# Altium schematic sheet Placa_Receptaculo_Gases_Sheet.SchDoc: Placa receptáculo gases
size 381 x 241 mm; Date: 19/10/2025; Author: Gerson T.& Lotfi D.; Organization: Universidad Distrital Francisco José de Caldas; DocumentNumber: 5; Revision: 1.0; SheetNumber: 5; SheetTotal: 5; Time: 16:24
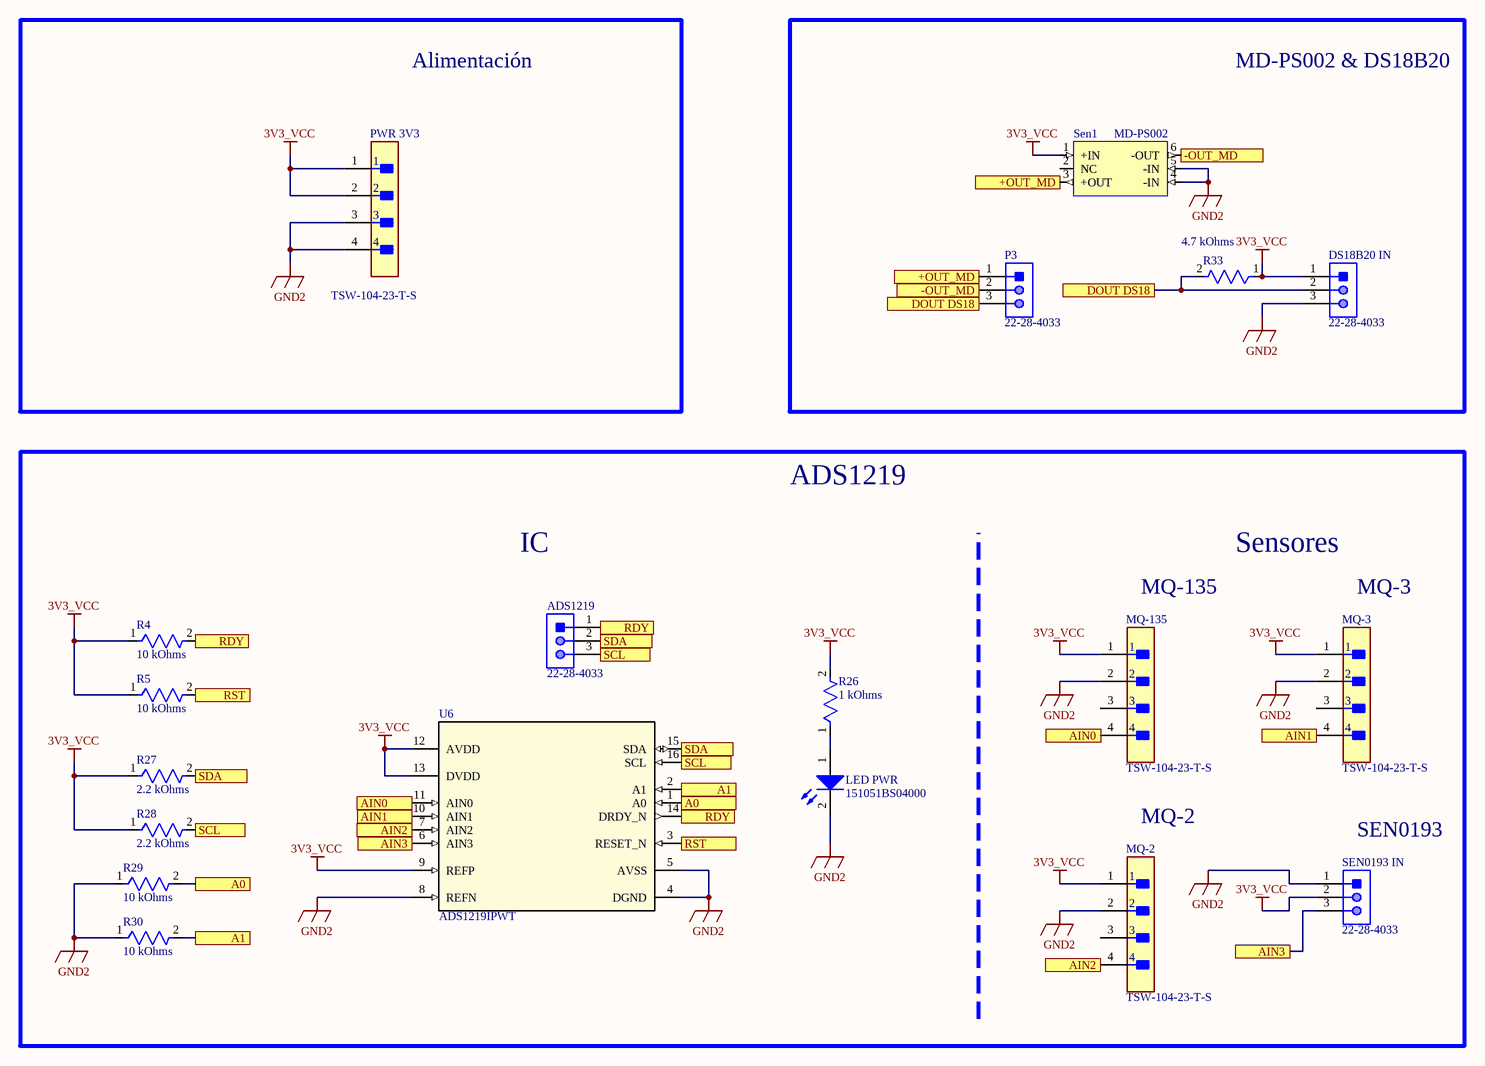
[diagram p0: Placa_Receptaculo_Gases_Sheet.SchDoc]

## Parts
ADS1219  22-28-4033  [MOLX-22-28-4033_V]
DS18B20_IN  22-28-4033  [MOLX-22-28-4033_V]
LED_PWR  151051BS04000  [WL-TMRC_D5.9H8.7]
MQ-2  TSW-104-23-T-S  [FP-TSW-104-23-T-S-MFG]
MQ-3  TSW-104-23-T-S  [FP-TSW-104-23-T-S-MFG]
MQ-135  TSW-104-23-T-S  [FP-TSW-104-23-T-S-MFG]
P3  22-28-4033  [MOLX-22-28-4033_V]
PWR_3V3  TSW-104-23-T-S  [FP-TSW-104-23-T-S-MFG]
R4  10 kOhms  [FP-FMP100-MFG]
R5  10 kOhms  [FP-FMP100-MFG]
R26  1 kOhms  [FP-FMP100-MFG]
R27  2.2 kOhms  [FP-FMP100-MFG]
R28  2.2 kOhms  [FP-FMP100-MFG]
R29  10 kOhms  [FP-FMP100-MFG]
R30  10 kOhms  [FP-FMP100-MFG]
R33  4.7 kOhms  [FP-FMP100-MFG]
Sen1  MD-PS002  [SPO-6 (MD-PS002)]
SEN0193_IN  22-28-4033  [MOLX-22-28-4033_V]
U6  ADS1219IPWT  [PW0016A_N]

## Blocks framed on the sheet
Alimentación: PWR_3V3
MD-PS002 & DS18B20: DS18B20_IN P3 R33 Sen1

## Ports
+OUT_MD (see Placa_Receptaculo_Gases_Sheet[4A]), +OUT_MD (see Placa_Receptaculo_Gases_Sheet[4B]), -OUT_MD (see Placa_Receptaculo_Gases_Sheet[4B]), -OUT_MD (see Placa_Receptaculo_Gases_Sheet[5A]), A0 (see Placa_Receptaculo_Gases_Sheet[2C]), A0 (see Placa_Receptaculo_Gases_Sheet[3C]), A1 (see Placa_Receptaculo_Gases_Sheet[2D]), A1 (see Placa_Receptaculo_Gases_Sheet[3C]), AIN0 (see Placa_Receptaculo_Gases_Sheet[2C]), AIN0 (see Placa_Receptaculo_Gases_Sheet[4C]), AIN1 (see Placa_Receptaculo_Gases_Sheet[2C]), AIN1 (see Placa_Receptaculo_Gases_Sheet[5C]), AIN2 (see Placa_Receptaculo_Gases_Sheet[2C]), AIN2 (see Placa_Receptaculo_Gases_Sheet[4D]), AIN3 (see Placa_Receptaculo_Gases_Sheet[2C]), AIN3 (see Placa_Receptaculo_Gases_Sheet[5D]), DOUT DS18 (see Placa_Receptaculo_Gases_Sheet[4B]), RDY (see Placa_Receptaculo_Gases_Sheet[2C], Placa_Receptaculo_Gases_Sheet[3C]), RDY (see Placa_Receptaculo_Gases_Sheet[3C]), RST (see Placa_Receptaculo_Gases_Sheet[2C]), RST (see Placa_Receptaculo_Gases_Sheet[3C]), SCL (see Placa_Receptaculo_Gases_Sheet[2C], Placa_Receptaculo_Gases_Sheet[3C]), SCL (see Placa_Receptaculo_Gases_Sheet[3C]), SDA (see Placa_Receptaculo_Gases_Sheet[2C], Placa_Receptaculo_Gases_Sheet[3C]), SDA (see Placa_Receptaculo_Gases_Sheet[3C])

## Nets
3V3_VCC: DS18B20_IN.1 MQ-2.1 MQ-3.1 MQ-135.1 PWR_3V3.1 PWR_3V3.2 R4.1 R5.1 R26.2 R27.1 R28.1 R33.1 Sen1.1(+IN) SEN0193_IN.2 U6.9(REFP) U6.12(AVDD) U6.13(DVDD)
GND2: DS18B20_IN.3 LED_PWR.2(K) MQ-2.2 MQ-3.2 MQ-135.2 PWR_3V3.3 PWR_3V3.4 R29.1 R30.1 Sen1.4(-IN) Sen1.5(-IN) SEN0193_IN.1 U6.4(DGND) U6.5(AVSS) U6.8(REFN)
+OUT_MD: P3.1 Sen1.3(+OUT) ; port +OUT_MD
-OUT_MD: P3.2 Sen1.6(-OUT) ; port -OUT_MD
A0: R29.2 U6.1(A0) ; port A0
A1: R30.2 U6.2(A1) ; port A1
AIN0: MQ-135.4 U6.11(AIN0) ; port AIN0
AIN1: MQ-3.4 U6.10(AIN1) ; port AIN1
AIN2: MQ-2.4 U6.7(AIN2) ; port AIN2
AIN3: SEN0193_IN.3 U6.6(AIN3) ; port AIN3
DOUT DS18: DS18B20_IN.2 P3.3 R33.2 ; port DOUT DS18
RDY: ADS1219.1 R4.2 U6.14(DRDY_N) ; port RDY
RST: R5.2 U6.3(RESET_N) ; port RST
SCL: ADS1219.3 R28.2 U6.16(SCL) ; port SCL
SDA: ADS1219.2 R27.2 U6.15(SDA) ; port SDA
NetLED_PWR_1: LED_PWR.1(A) R26.1

Not connected (* = marked no-connect by the designer): MQ-2 3; MQ-3 3; MQ-135 3; Sen1 2(NC)

## Notes on the sheet
- ADS1219
- IC
- Sensores
- MQ-135
- MQ-3
- MQ-2
- (near SEN0193_IN) SEN0193

## Library data of the parts
ADS1219 P3 SEN0193_IN = CMP-1676-00001-5: Male Header, Pitch 2.54 mm, 1 x 3 Position, Height 8.38 mm, Tail Length 3.18 mm, RoHS, Bulk; Manufacturer: Molex; Rows: 1; Voltage Rating: 250 V; Current Rating: 4 A; Min Operating Temperature: 0 degC; Lead Pitch: 0.1 inch; Packaging: Bulk; Contact Finish: Gold; RoHSCompliant: true; Contact Material: Brass; PackageReference: 22-28-4033; REACH SVHC: Unknown; PackageDescription: Male Header, Pitch 2.54 mm, 1 x 3 Position, Height 8.38 mm, Tail Length 3.18 mm; ComponentLink2URL: http://www.molex.com/pdm_docs/sd/022284033_sd.pdf; Height: 8.38 mm; Mounting Technology: Through Hole; ComponentLink1Description: Manufacturer URL; Length: 7.62 mm; Mount: Through Hole; DatasheetVersion: Rev. G, 01/2012; Max Operating Temperature: 75 degC; ComponentLink2Description: Datasheet; Colour: Black; Pins: 3; Contact Plating: Gold; Package Quantity: 1; ComponentLink1URL: http://www.molex.com/
DS18B20_IN = CMP-1676-00001-5: Male Header, Pitch 2.54 mm, 1 x 3 Position, Height 8.38 mm, Tail Length 3.18 mm, RoHS, Bulk; Manufacturer: Molex; Rows: 1; Voltage Rating: 250 V; Current Rating: 4 A; Colour: Black; Min Operating Temperature: 0 degC; Lead Pitch: 0.1 inch; Packaging: Bulk; Contact Finish: Gold; RoHSCompliant: true; Contact Material: Brass; PackageReference: 22-28-4033; REACH SVHC: Unknown; PackageDescription: Male Header, Pitch 2.54 mm, 1 x 3 Position, Height 8.38 mm, Tail Length 3.18 mm; ComponentLink2URL: http://www.molex.com/pdm_docs/sd/022284033_sd.pdf; Height: 8.38 mm; Mounting Technology: Through Hole; ComponentLink1Description: Manufacturer URL; Length: 7.62 mm; Mount: Through Hole; DatasheetVersion: Rev. G, 01/2012; Max Operating Temperature: 75 degC; ComponentLink2Description: Datasheet; Pins: 3; Contact Plating: Gold; Package Quantity: 1; ComponentLink1URL: http://www.molex.com/
LED_PWR = CMP-1488-00009-2: NexarPartId: 29717812; Test Current: 20mA; Forward Voltage: 3.2V; Wavelength: 470nm; Lens Size: 5mm; Lens Style: Circular, Diffused, Round; Forward Current: 100mA; Peak Wavelength: 465nm; Viewing Angle: 40°; Luminous Intensity: 500mcd; Max Reverse Voltage (DC): 5V; Case/Package: Radial; Width: 5mm; Mount: Through Hole; Min Operating Temperature: -40°C; Length: 5mm; Height: 8.6mm; Max Operating Temperature: 85°C; Packaging: Bulk; Color: Blue; RoHS: Compliant; REACH SVHC: Unknown; Dominant Wavelength: 470nm
MQ-2 MQ-3 MQ-135 PWR_3V3 = CMP-02766-001388-1: CONN HEADER VERT 4POS 2.54MM; Number of Contacts: 4; Gender: Male; Connector Type: Male Pin; Max Voltage Rating (AC): 550V; Max Current Rating: 7.6A; Radiation Hardening: No; Lead Free: Lead Free; RoHS Compliant: Yes; Contact Material: Bronze; Number of Positions: 4; Housing Color: Black; Min Operating Temperature: -55°C; Mount: Through Hole; Number of Rows: 1; Orientation: Straight; Contact Mating Length: 0.23inch; Contact Type: Male Pin; REACH SVHC: No SVHC; Max Operating Temperature: 105°C; Color: Black; Pitch: 2.54mm; Length: 10.16mm; Series: TSW; Packaging: Bulk; Contact Plating: Tin; Package Quantity: 1; Termination: Solder; Housing Material: Polyester; Width: 2.54mm; Depth: 2.54mm
R4 R5 R26-R30 R33 = CMP-00621-25629781-1: Resistor, 1 kOhm, ± 5%, 1 W, Axial Leaded, Metal Film, High Power Flame Proof; Power Rating: 1W; Resistance: 1kΩ; Temperature Coefficient: 100ppm/°C; Length: 6.3mm; Min Operating Temperature: -55°C; Tolerance: 5%; RoHS: Compliant; Military Standard: Not; Mount: Through Hole; Case/Package: Conformal; Diameter: 2.4mm; Schedule B: 8533210090, 8533210090; Radiation Hardening: No; Lead Free: Lead Free; Composition: Metal Film; Max Operating Temperature: 155°C; Termination: Axial
Sen1 = MD-PS002: Absolute pressure sensor; Pressure: 150 KPa; Topology: wheatstone bridge; ComponentLink2Description: datasheet; ComponentLink2URL: https://electronperdido.com/wp-content/uploads/2021/12/MD_PS002-Datasheet.zh-CN.en_.pdf; ComponentLink3Description: suplier; ComponentLink3URL: https://www.mactronica.com.co/sensor-de-presion-absoluta-md-ps002?srsltid=AfmBOorZAiXsJNmkeTgQPVhJ-_m5m52EX53D2zdWt7F5gRHtJGt4LCYa
U6 = ADS1219IPWT: 24-bit, 1kSPS, 4-ch general-purpose delta-sigma ADC with I2C interface and external Vref inputs 16-TSSOP -40 to 125; Manufacturer_Name: Texas Instruments; TYPE: TYPE; RefDes: RefDes; Copyright: Copyright (C) 2025 Ultra Librarian. All rights reserved.; Manufacturer_Part_Number: ADS1219IPWT; Datasheet: https://www.ti.com/lit/gpn/ads1219